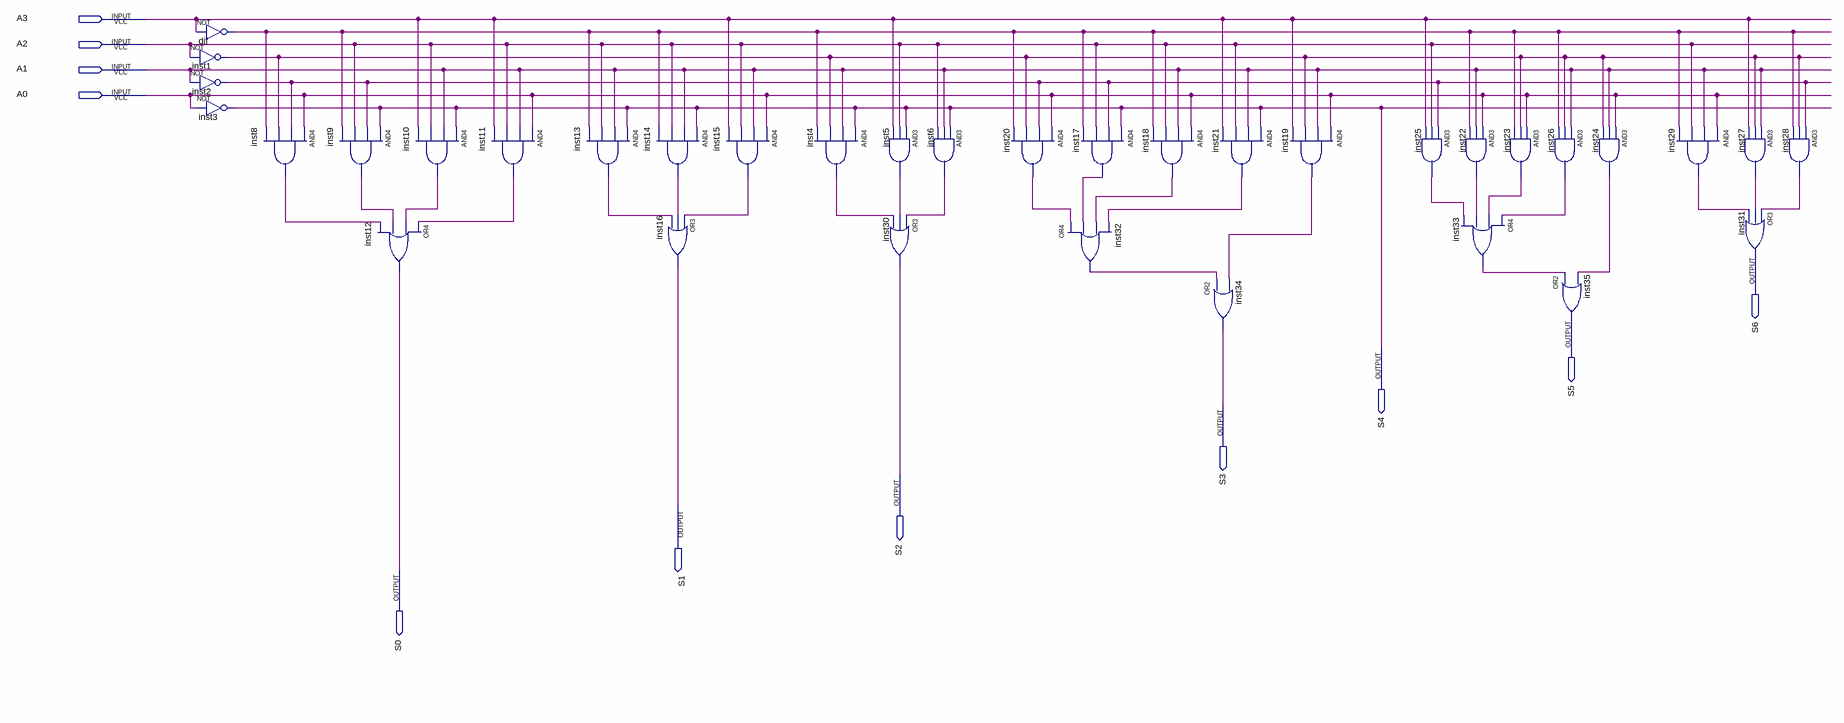
[diagram p0: schematic sheet]
// Quartus schematic decodificador4bits.bdf as structural Verilog: 35 symbols, 11 pins
module decodificador4bits (
  input  A3,
  input  A2,
  input  A1,
  input  A0,
  output S6,
  output S5,
  output S4,
  output S3,
  output S2,
  output S1,
  output S0
);

  wire dif_out, inst1_out, inst2_out, inst4_out, inst5_out, inst6_out, inst8_out, inst9_out, inst10_out,
       inst11_out, inst13_out, inst14_out, inst15_out, inst17_out, inst18_out, inst19_out, inst20_out,
       inst21_out, inst22_out, inst23_out, inst24_out, inst25_out, inst26_out, inst27_out, inst28_out,
       inst29_out, inst32_out, inst33_out;

  not dif (dif_out, A3);
  not inst1 (inst1_out, A2);
  not inst2 (inst2_out, A1);
  not inst3 (S4, A0);
  and inst8 (inst8_out, A0, inst2_out, inst1_out, dif_out);
  and inst9 (inst9_out, S4, inst2_out, A2, dif_out);
  or inst12 (S0, inst11_out, inst10_out, inst9_out, inst8_out);
  and inst10 (inst10_out, S4, A1, A2, A3);
  and inst11 (inst11_out, A0, A1, A2, A3);
  and inst13 (inst13_out, S4, A1, A2, dif_out);
  and inst14 (inst14_out, S4, A1, A2, dif_out);
  or inst16 (S1, inst15_out, inst14_out, inst13_out);
  and inst15 (inst15_out, A0, A1, A2, A3);
  and inst4 (inst4_out, S4, A1, inst1_out, dif_out);
  and inst5 (inst5_out, S4, A2, A3);
  or inst30 (S2, inst6_out, inst5_out, inst4_out);
  and inst6 (inst6_out, S4, A1, A2);
  and inst20 (inst20_out, A0, inst2_out, inst1_out, dif_out);
  and inst17 (inst17_out, S4, inst2_out, A2, dif_out);
  or inst32 (inst32_out, inst20_out, inst17_out, inst18_out, inst21_out);
  and inst18 (inst18_out, A0, A1, A2, dif_out);
  and inst21 (inst21_out, S4, A1, A2, A3);
  or inst34 (S3, inst32_out, inst19_out);
  and inst19 (inst19_out, A0, A1, inst1_out, A3);
  and inst25 (inst25_out, inst2_out, A2, A3);
  and inst22 (inst22_out, A0, A1, dif_out);
  or inst33 (inst33_out, inst26_out, inst23_out, inst22_out, inst25_out);
  and inst23 (inst23_out, A0, inst1_out, dif_out);
  and inst24 (inst24_out, A0, A1, inst1_out);
  and inst26 (inst26_out, A1, inst1_out, dif_out);
  // OR2 inst35 has open pins: IN1=inst33_out, IN2=inst24_out, OUT=open
  and inst29 (inst29_out, A0, A1, A2, dif_out);
  and inst27 (inst27_out, A1, inst1_out, A3);
  // OR3 inst31 has open pins: IN1=inst28_out, IN2=inst27_out, IN3=inst29_out, OUT=open
  and inst28 (inst28_out, inst2_out, inst1_out, dif_out);
endmodule
